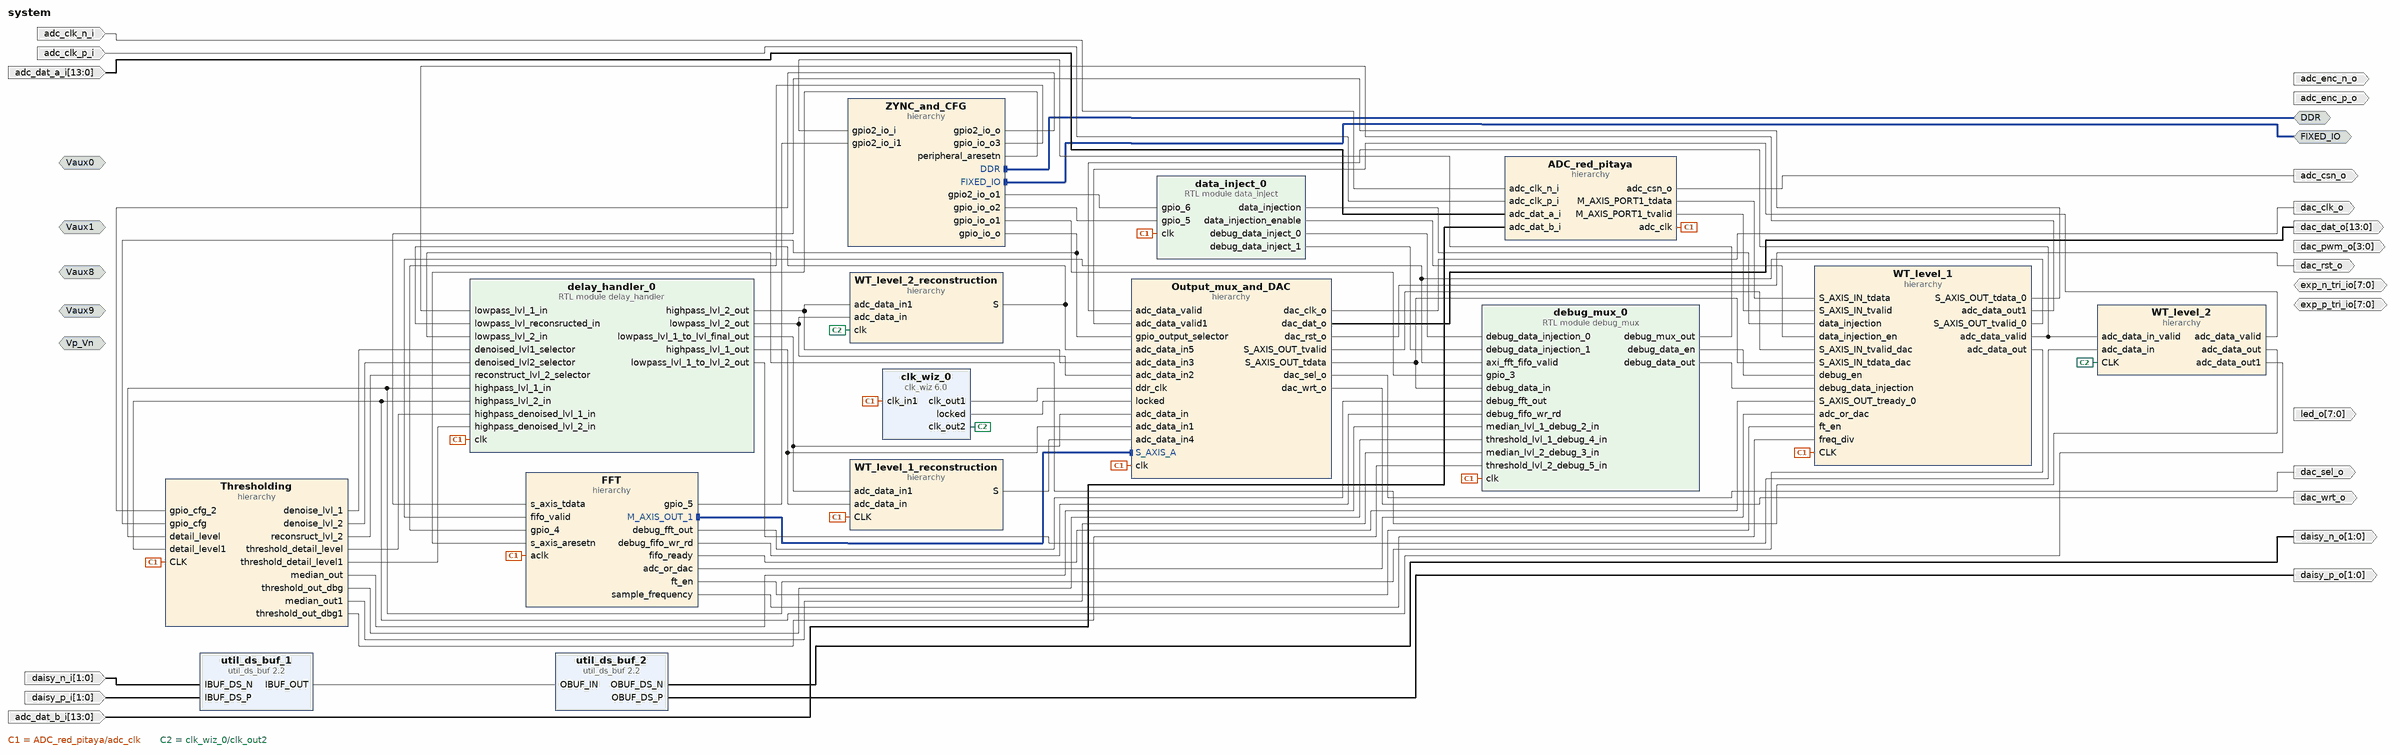
[diagram p0: block diagram of the top level]
# Vivado block design system, xc7z010clg400-1, Vivado 2022.2
create_bd_design system

create_bd_intf_port -mode Slave -vlnv xilinx.com:interface:diff_analog_io_rtl:1.0 Vp_Vn
create_bd_intf_port -mode Slave -vlnv xilinx.com:interface:diff_analog_io_rtl:1.0 Vaux0
create_bd_intf_port -mode Slave -vlnv xilinx.com:interface:diff_analog_io_rtl:1.0 Vaux1
create_bd_intf_port -mode Slave -vlnv xilinx.com:interface:diff_analog_io_rtl:1.0 Vaux9
create_bd_intf_port -mode Slave -vlnv xilinx.com:interface:diff_analog_io_rtl:1.0 Vaux8
create_bd_intf_port -mode Master -vlnv xilinx.com:interface:ddrx_rtl:1.0 DDR
create_bd_intf_port -mode Master -vlnv xilinx.com:display_processing_system7:fixedio_rtl:1.0 FIXED_IO
create_bd_port -dir I -from 13 -to 0 adc_dat_a_i
create_bd_port -dir I -from 13 -to 0 adc_dat_b_i
create_bd_port -dir I adc_clk_p_i
create_bd_port -dir I adc_clk_n_i
create_bd_port -dir O adc_enc_p_o
create_bd_port -dir O adc_enc_n_o
create_bd_port -dir O adc_csn_o
create_bd_port -dir O -from 13 -to 0 dac_dat_o
create_bd_port -dir O dac_clk_o
create_bd_port -dir O dac_rst_o
create_bd_port -dir O dac_sel_o
create_bd_port -dir O dac_wrt_o
create_bd_port -dir O -from 3 -to 0 dac_pwm_o
create_bd_port -dir IO -from 7 -to 0 exp_p_tri_io
create_bd_port -dir IO -from 7 -to 0 exp_n_tri_io
create_bd_port -dir O -from 1 -to 0 daisy_p_o
create_bd_port -dir O -from 1 -to 0 daisy_n_o
create_bd_port -dir I -from 1 -to 0 daisy_p_i
create_bd_port -dir I -from 1 -to 0 daisy_n_i
create_bd_port -dir O -from 7 -to 0 led_o

create_bd_cell -type ip -vlnv xilinx.com:ip:util_ds_buf:2.2 util_ds_buf_1
set_property -dict {CONFIG.C_SIZE 2} [get_bd_cells util_ds_buf_1]
create_bd_cell -type ip -vlnv xilinx.com:ip:util_ds_buf:2.2 util_ds_buf_2
set_property -dict {CONFIG.C_BUF_TYPE OBUFDS CONFIG.C_SIZE 2} [get_bd_cells util_ds_buf_2]
create_bd_cell -type ip -vlnv xilinx.com:ip:clk_wiz:6.0 clk_wiz_0
set_property -dict [list \
  CONFIG.CLKIN1_JITTER_PS 80.0 \
  CONFIG.CLKIN2_JITTER_PS 133.33 \
  CONFIG.CLKOUT1_JITTER 104.759 \
  CONFIG.CLKOUT1_PHASE_ERROR 96.948 \
  CONFIG.CLKOUT1_REQUESTED_OUT_FREQ 250.000 \
  CONFIG.CLKOUT2_JITTER 137.150 \
  CONFIG.CLKOUT2_PHASE_ERROR 96.948 \
  CONFIG.CLKOUT2_REQUESTED_OUT_FREQ 62.5 \
  CONFIG.CLKOUT2_USED true \
  CONFIG.CLKOUT3_JITTER 137.150 \
  CONFIG.CLKOUT3_PHASE_ERROR 96.948 \
  CONFIG.CLKOUT3_REQUESTED_OUT_FREQ 62.5 \
  CONFIG.CLKOUT3_USED false \
  CONFIG.MMCM_CLKFBOUT_MULT_F 8.000 \
  CONFIG.MMCM_CLKIN1_PERIOD 8.000 \
  CONFIG.MMCM_CLKIN2_PERIOD 10.000 \
  CONFIG.MMCM_CLKOUT0_DIVIDE_F 4.000 \
  CONFIG.MMCM_CLKOUT1_DIVIDE 16 \
  CONFIG.MMCM_CLKOUT2_DIVIDE 1 \
  CONFIG.MMCM_DIVCLK_DIVIDE 1 \
  CONFIG.NUM_OUT_CLKS 2 \
  CONFIG.PRIM_IN_FREQ 125.000 \
  CONFIG.SECONDARY_IN_FREQ 100.000 \
  CONFIG.SECONDARY_SOURCE Single_ended_clock_capable_pin \
  CONFIG.USE_INCLK_SWITCHOVER false \
  CONFIG.USE_RESET true \
] [get_bd_cells clk_wiz_0]
create_bd_cell -type hier ADC_red_pitaya
create_bd_cell -type module -reference data_inject data_inject_0
create_bd_cell -type module -reference delay_handler delay_handler_0
create_bd_cell -type hier FFT
create_bd_cell -type hier WT_level_1
create_bd_cell -type hier WT_level_2
create_bd_cell -type hier WT_level_1_reconstruction
create_bd_cell -type hier ZYNC_and_CFG
create_bd_cell -type hier Thresholding
create_bd_cell -type hier Output_mux_and_DAC
create_bd_cell -type hier WT_level_2_reconstruction
create_bd_cell -type module -reference debug_mux debug_mux_0

# ---- hierarchy /ADC_red_pitaya ----
current_bd_instance /ADC_red_pitaya
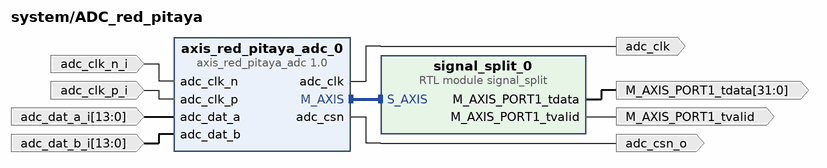
[diagram p1: block diagram inside /ADC_red_pitaya]
create_bd_pin -dir O -type clk adc_clk
create_bd_pin -dir O adc_csn_o
create_bd_pin -dir I adc_clk_p_i
create_bd_pin -dir I adc_clk_n_i
create_bd_pin -dir I -from 13 -to 0 adc_dat_a_i
create_bd_pin -dir I -from 13 -to 0 adc_dat_b_i
create_bd_pin -dir O -from 31 -to 0 M_AXIS_PORT1_tdata
create_bd_pin -dir O M_AXIS_PORT1_tvalid

create_bd_cell -type module -reference signal_split signal_split_0
create_bd_cell -type ip -vlnv pavel-demin:user:axis_red_pitaya_adc:1.0 axis_red_pitaya_adc_0

# ---- hierarchy /FFT ----
current_bd_instance /FFT
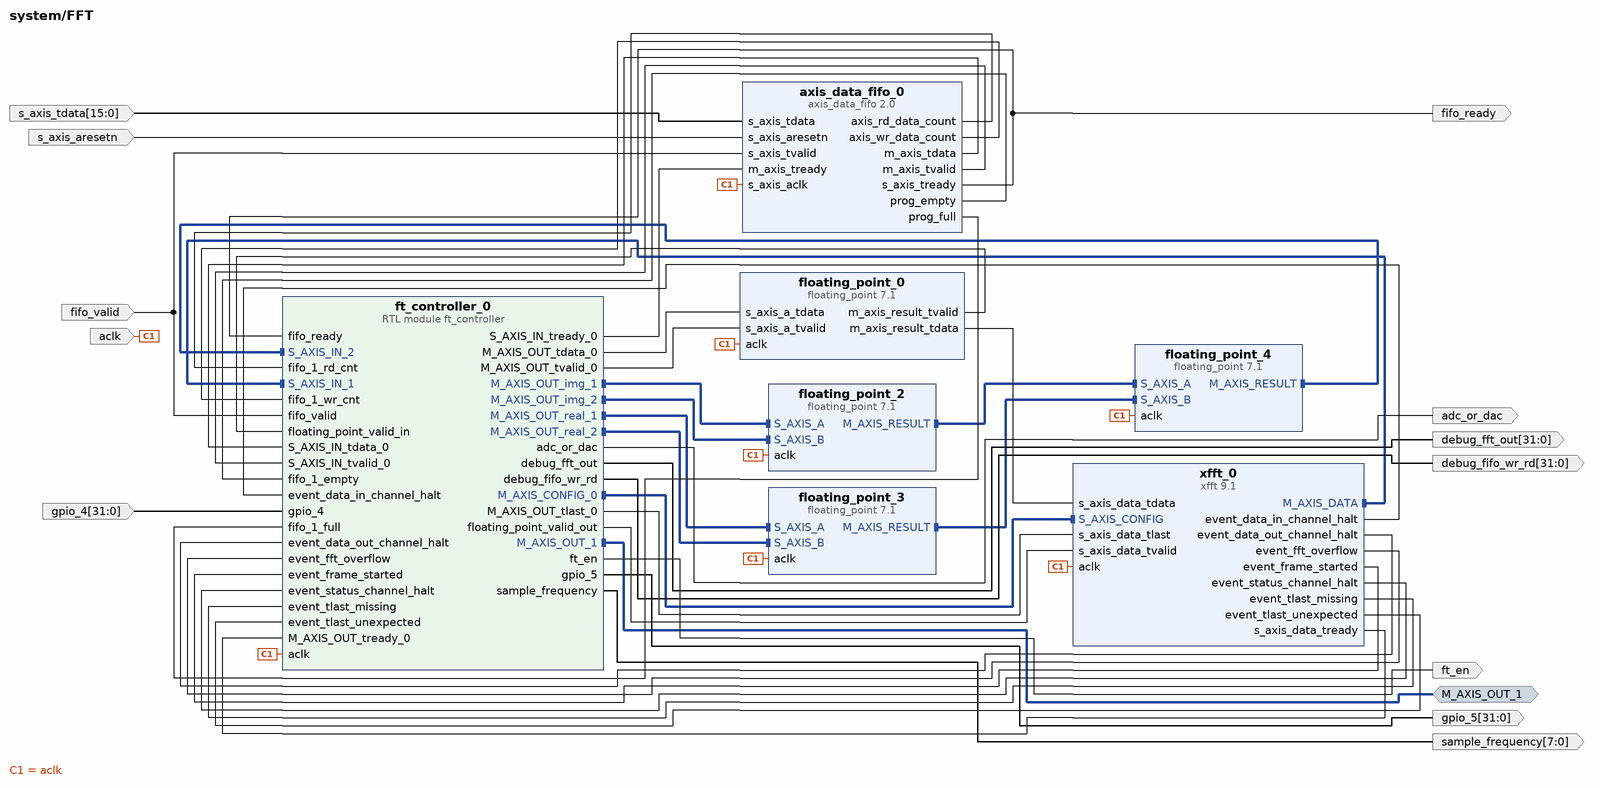
[diagram p2: block diagram inside /FFT]
create_bd_intf_pin -mode Master -vlnv xilinx.com:interface:axis_rtl:1.0 M_AXIS_OUT_1
create_bd_pin -dir I -type rst s_axis_aresetn
create_bd_pin -dir I -type clk aclk
create_bd_pin -dir I fifo_valid
create_bd_pin -dir O fifo_ready
create_bd_pin -dir I -from 15 -to 0 s_axis_tdata
create_bd_pin -dir I -from 31 -to 0 gpio_4
create_bd_pin -dir O -from 31 -to 0 gpio_5
create_bd_pin -dir O ft_en
create_bd_pin -dir O -from 7 -to 0 sample_frequency
create_bd_pin -dir O adc_or_dac
create_bd_pin -dir O -from 31 -to 0 debug_fft_out
create_bd_pin -dir O -from 31 -to 0 debug_fifo_wr_rd

create_bd_cell -type ip -vlnv xilinx.com:ip:axis_data_fifo:2.0 axis_data_fifo_0
set_property -dict [list \
  CONFIG.FIFO_DEPTH 4096 \
  CONFIG.HAS_PROG_EMPTY 1 \
  CONFIG.HAS_PROG_FULL 1 \
  CONFIG.HAS_RD_DATA_COUNT 1 \
  CONFIG.HAS_WR_DATA_COUNT 1 \
  CONFIG.PROG_FULL_THRESH 4091 \
  CONFIG.TDATA_NUM_BYTES 2 \
] [get_bd_cells axis_data_fifo_0]
create_bd_cell -type ip -vlnv xilinx.com:ip:floating_point:7.1 floating_point_3
set_property -dict [list \
  CONFIG.A_Precision_Type Single \
  CONFIG.C_A_Exponent_Width 8 \
  CONFIG.C_A_Fraction_Width 24 \
  CONFIG.C_Accum_Input_Msb -1 \
  CONFIG.C_Accum_Lsb -10 \
  CONFIG.C_Accum_Msb 32 \
  CONFIG.C_Latency 6 \
  CONFIG.C_Mult_Usage Max_Usage \
  CONFIG.C_Rate 1 \
  CONFIG.C_Result_Exponent_Width 8 \
  CONFIG.C_Result_Fraction_Width 24 \
  CONFIG.Flow_Control NonBlocking \
  CONFIG.Has_A_TLAST false \
  CONFIG.Has_RESULT_TREADY false \
  CONFIG.Maximum_Latency false \
  CONFIG.Operation_Type Multiply \
  CONFIG.RESULT_TLAST_Behv Null \
  CONFIG.Result_Precision_Type Single \
] [get_bd_cells floating_point_3]
create_bd_cell -type ip -vlnv xilinx.com:ip:floating_point:7.1 floating_point_4
set_property -dict [list \
  CONFIG.A_Precision_Type Single \
  CONFIG.Add_Sub_Value Add \
  CONFIG.C_A_Exponent_Width 8 \
  CONFIG.C_A_Fraction_Width 24 \
  CONFIG.C_Accum_Input_Msb -1 \
  CONFIG.C_Accum_Lsb -10 \
  CONFIG.C_Accum_Msb 32 \
  CONFIG.C_Latency 11 \
  CONFIG.C_Mult_Usage Full_Usage \
  CONFIG.C_Rate 1 \
  CONFIG.C_Result_Exponent_Width 8 \
  CONFIG.C_Result_Fraction_Width 24 \
  CONFIG.Flow_Control NonBlocking \
  CONFIG.Has_A_TLAST false \
  CONFIG.Has_RESULT_TREADY false \
  CONFIG.Maximum_Latency false \
  CONFIG.Operation_Type Add_Subtract \
  CONFIG.RESULT_TLAST_Behv Null \
  CONFIG.Result_Precision_Type Single \
] [get_bd_cells floating_point_4]
create_bd_cell -type ip -vlnv xilinx.com:ip:xfft:9.1 xfft_0
set_property -dict [list \
  CONFIG.data_format floating_point \
  CONFIG.implementation_options automatically_select \
  CONFIG.input_width 32 \
  CONFIG.number_of_stages_using_block_ram_for_data_and_phase_factors 5 \
  CONFIG.output_ordering natural_order \
  CONFIG.ovflo true \
  CONFIG.phase_factor_width 24 \
  CONFIG.run_time_configurable_transform_length true \
  CONFIG.target_clock_frequency 125 \
  CONFIG.transform_length 4096 \
] [get_bd_cells xfft_0]
create_bd_cell -type ip -vlnv xilinx.com:ip:floating_point:7.1 floating_point_0
set_property -dict [list \
  CONFIG.A_Precision_Type Custom \
  CONFIG.C_A_Exponent_Width 1 \
  CONFIG.C_A_Fraction_Width 13 \
  CONFIG.C_Accum_Input_Msb -1 \
  CONFIG.C_Accum_Lsb -10 \
  CONFIG.C_Accum_Msb 32 \
  CONFIG.C_Latency 6 \
  CONFIG.C_Mult_Usage No_Usage \
  CONFIG.C_Rate 1 \
  CONFIG.C_Result_Exponent_Width 8 \
  CONFIG.C_Result_Fraction_Width 24 \
  CONFIG.Flow_Control NonBlocking \
  CONFIG.Has_A_TLAST false \
  CONFIG.Has_RESULT_TREADY false \
  CONFIG.Maximum_Latency true \
  CONFIG.Operation_Type Fixed_to_float \
  CONFIG.RESULT_TLAST_Behv Null \
  CONFIG.Result_Precision_Type Single \
] [get_bd_cells floating_point_0]
create_bd_cell -type ip -vlnv xilinx.com:ip:floating_point:7.1 floating_point_2
set_property -dict [list \
  CONFIG.A_Precision_Type Single \
  CONFIG.C_A_Exponent_Width 8 \
  CONFIG.C_A_Fraction_Width 24 \
  CONFIG.C_Accum_Input_Msb -1 \
  CONFIG.C_Accum_Lsb -10 \
  CONFIG.C_Accum_Msb 32 \
  CONFIG.C_Latency 6 \
  CONFIG.C_Mult_Usage Max_Usage \
  CONFIG.C_Rate 1 \
  CONFIG.C_Result_Exponent_Width 8 \
  CONFIG.C_Result_Fraction_Width 24 \
  CONFIG.Flow_Control NonBlocking \
  CONFIG.Has_A_TLAST false \
  CONFIG.Has_RESULT_TREADY false \
  CONFIG.Maximum_Latency false \
  CONFIG.Operation_Type Multiply \
  CONFIG.RESULT_TLAST_Behv Null \
  CONFIG.Result_Precision_Type Single \
] [get_bd_cells floating_point_2]
create_bd_cell -type module -reference ft_controller ft_controller_0

# ---- hierarchy /WT_level_1 ----
current_bd_instance /WT_level_1
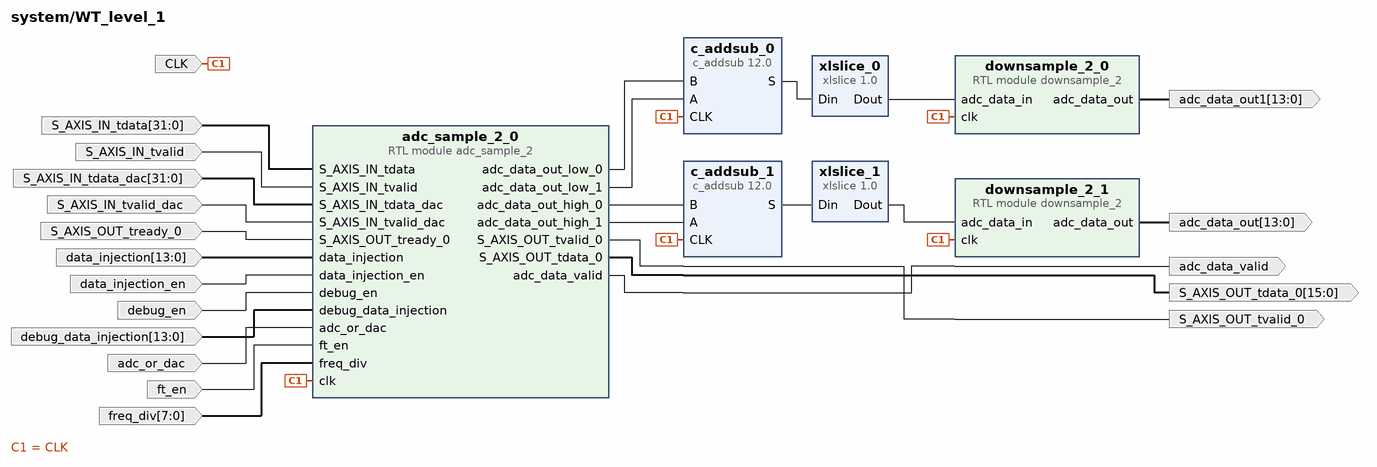
[diagram p3: block diagram inside /WT_level_1]
create_bd_pin -dir I -type clk CLK
create_bd_pin -dir O -from 13 -to 0 adc_data_out
create_bd_pin -dir I -from 31 -to 0 S_AXIS_IN_tdata
create_bd_pin -dir I S_AXIS_IN_tvalid
create_bd_pin -dir I -from 13 -to 0 debug_data_injection
create_bd_pin -dir I debug_en
create_bd_pin -dir I -from 13 -to 0 data_injection
create_bd_pin -dir I data_injection_en
create_bd_pin -dir I -from 31 -to 0 S_AXIS_IN_tdata_dac
create_bd_pin -dir I S_AXIS_IN_tvalid_dac
create_bd_pin -dir I ft_en
create_bd_pin -dir I -from 7 -to 0 freq_div
create_bd_pin -dir I adc_or_dac
create_bd_pin -dir O adc_data_valid
create_bd_pin -dir O -from 15 -to 0 S_AXIS_OUT_tdata_0
create_bd_pin -dir O S_AXIS_OUT_tvalid_0
create_bd_pin -dir I S_AXIS_OUT_tready_0
create_bd_pin -dir O -from 13 -to 0 adc_data_out1

create_bd_cell -type ip -vlnv xilinx.com:ip:xlslice:1.0 xlslice_0
set_property -dict {CONFIG.DIN_FROM 14 CONFIG.DIN_TO 1 CONFIG.DIN_WIDTH 15} [get_bd_cells xlslice_0]
create_bd_cell -type ip -vlnv xilinx.com:ip:xlslice:1.0 xlslice_1
set_property -dict {CONFIG.DIN_FROM 14 CONFIG.DIN_TO 1 CONFIG.DIN_WIDTH 15} [get_bd_cells xlslice_1]
create_bd_cell -type module -reference downsample_2 downsample_2_1
create_bd_cell -type ip -vlnv xilinx.com:ip:c_addsub:12.0 c_addsub_0
set_property -dict [list \
  CONFIG.A_Type Signed \
  CONFIG.A_Width 14 \
  CONFIG.B_Type Signed \
  CONFIG.B_Value 00000000000000 \
  CONFIG.B_Width 14 \
  CONFIG.CE false \
  CONFIG.Latency 1 \
  CONFIG.Out_Width 15 \
] [get_bd_cells c_addsub_0]
create_bd_cell -type ip -vlnv xilinx.com:ip:c_addsub:12.0 c_addsub_1
set_property -dict [list \
  CONFIG.A_Type Signed \
  CONFIG.A_Width 14 \
  CONFIG.Add_Mode Subtract \
  CONFIG.B_Type Signed \
  CONFIG.B_Value 00000000000000 \
  CONFIG.B_Width 14 \
  CONFIG.CE false \
  CONFIG.Latency 1 \
  CONFIG.Out_Width 15 \
] [get_bd_cells c_addsub_1]
create_bd_cell -type module -reference downsample_2 downsample_2_0
create_bd_cell -type module -reference adc_sample_2 adc_sample_2_0

# ---- hierarchy /WT_level_2 ----
current_bd_instance /WT_level_2
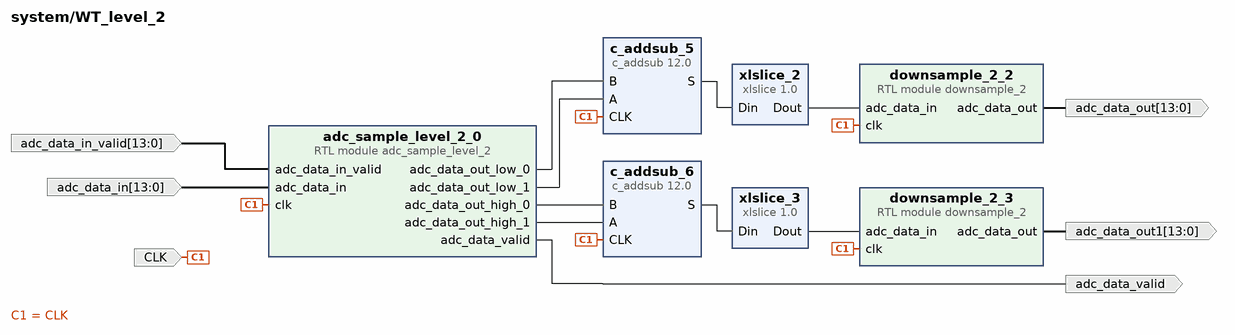
[diagram p4: block diagram inside /WT_level_2]
create_bd_pin -dir I -type clk CLK
create_bd_pin -dir O -from 13 -to 0 adc_data_out
create_bd_pin -dir I -from 13 -to 0 adc_data_in
create_bd_pin -dir I -from 13 -to 0 adc_data_in_valid
create_bd_pin -dir O adc_data_valid
create_bd_pin -dir O -from 13 -to 0 adc_data_out1

create_bd_cell -type ip -vlnv xilinx.com:ip:c_addsub:12.0 c_addsub_6
set_property -dict [list \
  CONFIG.A_Type Signed \
  CONFIG.A_Width 14 \
  CONFIG.Add_Mode Subtract \
  CONFIG.B_Type Signed \
  CONFIG.B_Value 00000000000000 \
  CONFIG.B_Width 14 \
  CONFIG.CE false \
  CONFIG.Latency 1 \
  CONFIG.Out_Width 15 \
] [get_bd_cells c_addsub_6]
create_bd_cell -type ip -vlnv xilinx.com:ip:xlslice:1.0 xlslice_2
set_property -dict {CONFIG.DIN_FROM 14 CONFIG.DIN_TO 1 CONFIG.DIN_WIDTH 15} [get_bd_cells xlslice_2]
create_bd_cell -type ip -vlnv xilinx.com:ip:xlslice:1.0 xlslice_3
set_property -dict {CONFIG.DIN_FROM 14 CONFIG.DIN_TO 1 CONFIG.DIN_WIDTH 15} [get_bd_cells xlslice_3]
create_bd_cell -type module -reference downsample_2 downsample_2_2
create_bd_cell -type module -reference adc_sample_level_2 adc_sample_level_2_0
create_bd_cell -type ip -vlnv xilinx.com:ip:c_addsub:12.0 c_addsub_5
set_property -dict [list \
  CONFIG.A_Type Signed \
  CONFIG.A_Width 14 \
  CONFIG.B_Type Signed \
  CONFIG.B_Value 00000000000000 \
  CONFIG.B_Width 14 \
  CONFIG.CE false \
  CONFIG.Latency 1 \
  CONFIG.Out_Width 15 \
] [get_bd_cells c_addsub_5]
create_bd_cell -type module -reference downsample_2 downsample_2_3

# ---- hierarchy /WT_level_1_reconstruction ----
current_bd_instance /WT_level_1_reconstruction
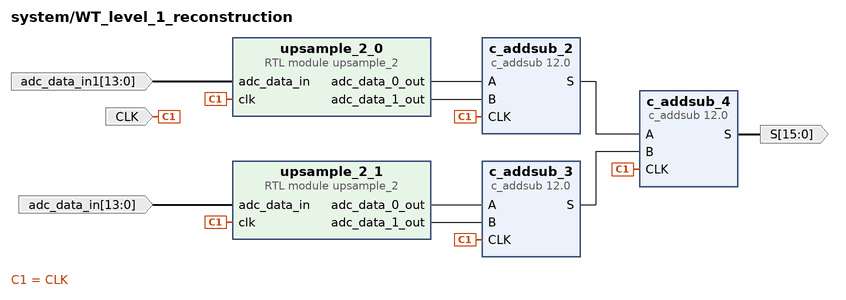
[diagram p5: block diagram inside /WT_level_1_reconstruction]
create_bd_pin -dir I -from 13 -to 0 adc_data_in
create_bd_pin -dir I -type clk CLK
create_bd_pin -dir O -from 15 -to 0 -type data S
create_bd_pin -dir I -from 13 -to 0 adc_data_in1

create_bd_cell -type module -reference upsample_2 upsample_2_1
create_bd_cell -type ip -vlnv xilinx.com:ip:c_addsub:12.0 c_addsub_2
set_property -dict [list \
  CONFIG.A_Type Signed \
  CONFIG.A_Width 14 \
  CONFIG.B_Type Signed \
  CONFIG.B_Value 00000000000000 \
  CONFIG.B_Width 14 \
  CONFIG.CE false \
  CONFIG.Latency 1 \
  CONFIG.Out_Width 15 \
] [get_bd_cells c_addsub_2]
create_bd_cell -type ip -vlnv xilinx.com:ip:c_addsub:12.0 c_addsub_3
set_property -dict [list \
  CONFIG.A_Type Signed \
  CONFIG.A_Width 14 \
  CONFIG.Add_Mode Subtract \
  CONFIG.B_Type Signed \
  CONFIG.B_Value 00000000000000 \
  CONFIG.B_Width 14 \
  CONFIG.CE false \
  CONFIG.Latency 1 \
  CONFIG.Out_Width 15 \
] [get_bd_cells c_addsub_3]
create_bd_cell -type ip -vlnv xilinx.com:ip:c_addsub:12.0 c_addsub_4
set_property -dict {CONFIG.CE false CONFIG.Latency 1 CONFIG.Out_Width 16} [get_bd_cells c_addsub_4]
create_bd_cell -type module -reference upsample_2 upsample_2_0

# ---- hierarchy /ZYNC_and_CFG ----
current_bd_instance /ZYNC_and_CFG
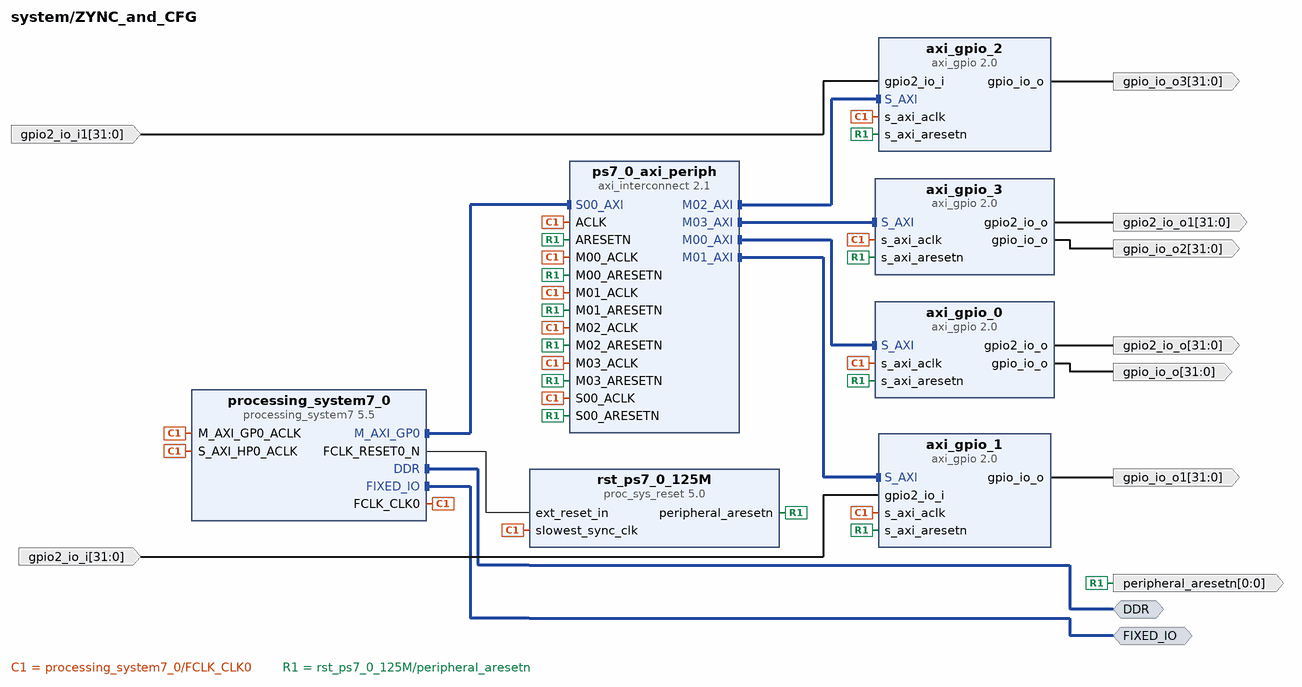
[diagram p6: block diagram inside /ZYNC_and_CFG]
create_bd_intf_pin -mode Master -vlnv xilinx.com:interface:ddrx_rtl:1.0 DDR
create_bd_intf_pin -mode Master -vlnv xilinx.com:display_processing_system7:fixedio_rtl:1.0 FIXED_IO
create_bd_pin -dir O -from 0 -to 0 -type rst peripheral_aresetn
create_bd_pin -dir O -from 31 -to 0 gpio_io_o
create_bd_pin -dir O -from 31 -to 0 gpio2_io_o
create_bd_pin -dir O -from 31 -to 0 gpio_io_o1
create_bd_pin -dir I -from 31 -to 0 gpio2_io_i
create_bd_pin -dir O -from 31 -to 0 gpio_io_o2
create_bd_pin -dir O -from 31 -to 0 gpio2_io_o1
create_bd_pin -dir O -from 31 -to 0 gpio_io_o3
create_bd_pin -dir I -from 31 -to 0 gpio2_io_i1

create_bd_cell -type ip -vlnv xilinx.com:ip:processing_system7:5.5 processing_system7_0
set_property -dict [list \
  CONFIG.PCW_APU_PERIPHERAL_FREQMHZ 666.666666 \
  CONFIG.PCW_ENET0_ENET0_IO {MIO 16 .. 27} \
  CONFIG.PCW_ENET0_GRP_MDIO_ENABLE 1 \
  CONFIG.PCW_ENET0_GRP_MDIO_IO EMIO \
  CONFIG.PCW_ENET0_PERIPHERAL_ENABLE 1 \
  CONFIG.PCW_ENET0_RESET_ENABLE 0 \
  CONFIG.PCW_ENET_RESET_ENABLE 1 \
  CONFIG.PCW_ENET_RESET_SELECT {Share reset pin} \
  CONFIG.PCW_FPGA0_PERIPHERAL_FREQMHZ 125 \
  CONFIG.PCW_FPGA1_PERIPHERAL_FREQMHZ 250 \
  CONFIG.PCW_FPGA3_PERIPHERAL_FREQMHZ 200 \
  CONFIG.PCW_GPIO_MIO_GPIO_ENABLE 1 \
  CONFIG.PCW_GPIO_MIO_GPIO_IO MIO \
  CONFIG.PCW_GPIO_PERIPHERAL_ENABLE 1 \
  CONFIG.PCW_I2C0_GRP_INT_ENABLE 0 \
  CONFIG.PCW_I2C0_I2C0_IO {MIO 50 .. 51} \
  CONFIG.PCW_I2C0_PERIPHERAL_ENABLE 1 \
  CONFIG.PCW_I2C_PERIPHERAL_FREQMHZ 111.111115 \
  CONFIG.PCW_I2C_RESET_ENABLE 1 \
  CONFIG.PCW_I2C_RESET_SELECT {Share reset pin} \
  CONFIG.PCW_IMPORT_BOARD_PRESET cfg/red_pitaya.xml \
  CONFIG.PCW_PRESET_BANK1_VOLTAGE {LVCMOS 2.5V} \
  CONFIG.PCW_QSPI_GRP_SINGLE_SS_ENABLE 1 \
  CONFIG.PCW_QSPI_GRP_SINGLE_SS_IO {MIO 1 .. 6} \
  CONFIG.PCW_QSPI_PERIPHERAL_ENABLE 1 \
  CONFIG.PCW_QSPI_PERIPHERAL_FREQMHZ 125 \
  CONFIG.PCW_QSPI_QSPI_IO {MIO 1 .. 6} \
  CONFIG.PCW_SD0_GRP_CD_ENABLE 1 \
  CONFIG.PCW_SD0_GRP_CD_IO {MIO 46} \
  CONFIG.PCW_SD0_GRP_WP_ENABLE 1 \
  CONFIG.PCW_SD0_GRP_WP_IO {MIO 47} \
  CONFIG.PCW_SD0_PERIPHERAL_ENABLE 1 \
  CONFIG.PCW_SD0_SD0_IO {MIO 40 .. 45} \
  CONFIG.PCW_SDIO_PERIPHERAL_FREQMHZ 100 \
  CONFIG.PCW_SINGLE_QSPI_DATA_MODE x4 \
  CONFIG.PCW_SPI0_PERIPHERAL_ENABLE 1 \
  CONFIG.PCW_SPI0_SPI0_IO EMIO \
  CONFIG.PCW_SPI1_PERIPHERAL_ENABLE 1 \
  CONFIG.PCW_SPI1_SPI1_IO {MIO 10 .. 15} \
  CONFIG.PCW_TTC0_PERIPHERAL_ENABLE 1 \
  CONFIG.PCW_TTC0_TTC0_IO EMIO \
  CONFIG.PCW_UART0_PERIPHERAL_ENABLE 1 \
  CONFIG.PCW_UART0_UART0_IO {MIO 14 .. 15} \
  CONFIG.PCW_UART1_PERIPHERAL_ENABLE 1 \
  CONFIG.PCW_UART1_UART1_IO {MIO 8 .. 9} \
  CONFIG.PCW_UART_PERIPHERAL_FREQMHZ 100 \
  CONFIG.PCW_UIPARAM_DDR_BUS_WIDTH {16 Bit} \
  CONFIG.PCW_UIPARAM_DDR_FREQ_MHZ 533.333333 \
  CONFIG.PCW_UIPARAM_DDR_PARTNO {MT41J256M16 RE-125} \
  CONFIG.PCW_USB0_PERIPHERAL_ENABLE 1 \
  CONFIG.PCW_USB0_RESET_ENABLE 1 \
  CONFIG.PCW_USB0_RESET_IO {MIO 48} \
  CONFIG.PCW_USB0_USB0_IO {MIO 28 .. 39} \
  CONFIG.PCW_USB_RESET_ENABLE 1 \
  CONFIG.PCW_USB_RESET_SELECT {Share reset pin} \
  CONFIG.PCW_USE_S_AXI_HP0 1 \
] [get_bd_cells processing_system7_0]
# 429 more settings of processing_system7_0 are not shown: defaults, MIO pin electricals, DDR timing, and values the tool derives
create_bd_cell -type ip -vlnv xilinx.com:ip:axi_gpio:2.0 axi_gpio_0
set_property -dict [list \
  CONFIG.C_ALL_INPUTS_2 0 \
  CONFIG.C_ALL_OUTPUTS 1 \
  CONFIG.C_ALL_OUTPUTS_2 1 \
  CONFIG.C_DOUT_DEFAULT 0x8C180001 \
  CONFIG.C_DOUT_DEFAULT_2 0x00002000 \
  CONFIG.C_IS_DUAL 1 \
] [get_bd_cells axi_gpio_0]
create_bd_cell -type ip -vlnv xilinx.com:ip:axi_gpio:2.0 axi_gpio_1
set_property -dict [list \
  CONFIG.C_ALL_INPUTS 0 \
  CONFIG.C_ALL_INPUTS_2 1 \
  CONFIG.C_ALL_OUTPUTS 1 \
  CONFIG.C_DOUT_DEFAULT 0x00000000 \
  CONFIG.C_INTERRUPT_PRESENT 0 \
  CONFIG.C_IS_DUAL 1 \
] [get_bd_cells axi_gpio_1]
create_bd_cell -type ip -vlnv xilinx.com:ip:axi_gpio:2.0 axi_gpio_3
set_property -dict [list \
  CONFIG.C_ALL_INPUTS_2 0 \
  CONFIG.C_ALL_OUTPUTS 1 \
  CONFIG.C_ALL_OUTPUTS_2 1 \
  CONFIG.C_DOUT_DEFAULT 0x00000000 \
  CONFIG.C_DOUT_DEFAULT_2 0x00000000 \
  CONFIG.C_IS_DUAL 1 \
] [get_bd_cells axi_gpio_3]
create_bd_cell -type ip -vlnv xilinx.com:ip:proc_sys_reset:5.0 rst_ps7_0_125M
create_bd_cell -type ip -vlnv xilinx.com:ip:axi_gpio:2.0 axi_gpio_2
set_property -dict [list \
  CONFIG.C_ALL_INPUTS_2 1 \
  CONFIG.C_ALL_OUTPUTS 1 \
  CONFIG.C_DOUT_DEFAULT 0x0000002C \
  CONFIG.C_IS_DUAL 1 \
] [get_bd_cells axi_gpio_2]
create_bd_cell -type ip -vlnv xilinx.com:ip:axi_interconnect:2.1 ps7_0_axi_periph
set_property -dict {CONFIG.NUM_MI 4 CONFIG.NUM_SI 1} [get_bd_cells ps7_0_axi_periph]

# ---- hierarchy /Thresholding ----
current_bd_instance /Thresholding
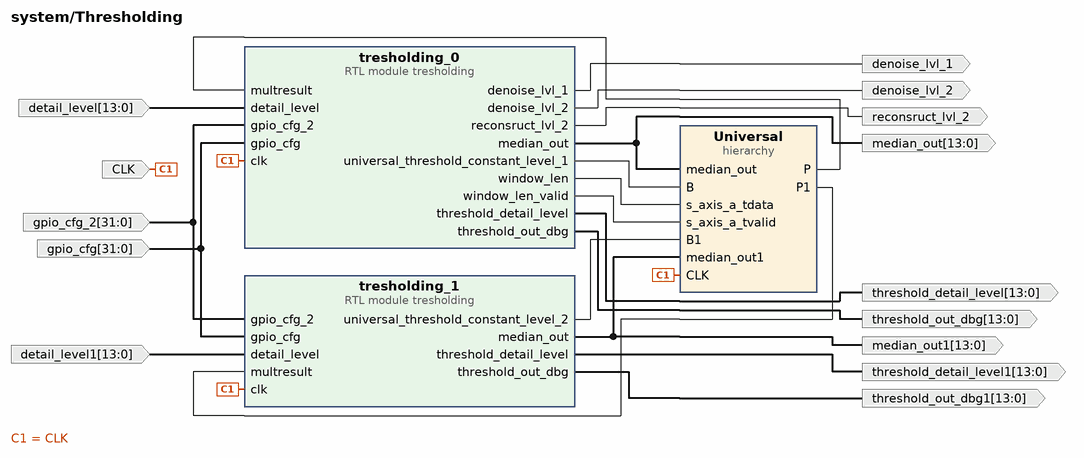
[diagram p7: block diagram inside /Thresholding]
create_bd_pin -dir I -type clk CLK
create_bd_pin -dir O -from 13 -to 0 median_out
create_bd_pin -dir I -from 13 -to 0 detail_level
create_bd_pin -dir I -from 31 -to 0 gpio_cfg
create_bd_pin -dir I -from 31 -to 0 gpio_cfg_2
create_bd_pin -dir O -from 13 -to 0 threshold_detail_level
create_bd_pin -dir O -from 13 -to 0 threshold_out_dbg
create_bd_pin -dir O denoise_lvl_1
create_bd_pin -dir O denoise_lvl_2
create_bd_pin -dir O reconsruct_lvl_2
create_bd_pin -dir O -from 13 -to 0 median_out1
create_bd_pin -dir I -from 13 -to 0 detail_level1
create_bd_pin -dir O -from 13 -to 0 threshold_detail_level1
create_bd_pin -dir O -from 13 -to 0 threshold_out_dbg1

create_bd_cell -type hier Universal
create_bd_cell -type module -reference tresholding tresholding_0
create_bd_cell -type module -reference tresholding tresholding_1

# ---- hierarchy /Thresholding/Universal ----
current_bd_instance /Thresholding/Universal
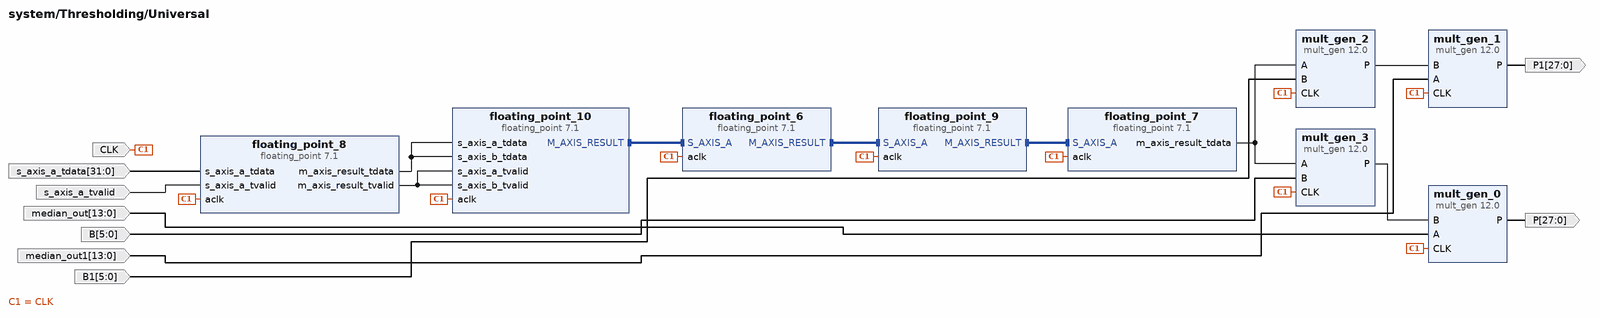
[diagram p8: block diagram inside /Thresholding/Universal]
create_bd_pin -dir I -type clk CLK
create_bd_pin -dir I -from 13 -to 0 median_out
create_bd_pin -dir O -from 27 -to 0 -type data P
create_bd_pin -dir I -from 13 -to 0 -type data median_out1
create_bd_pin -dir O -from 27 -to 0 -type data P1
create_bd_pin -dir I -from 5 -to 0 -type data B
create_bd_pin -dir I s_axis_a_tvalid
create_bd_pin -dir I -from 31 -to 0 s_axis_a_tdata
create_bd_pin -dir I -from 5 -to 0 -type data B1

create_bd_cell -type ip -vlnv xilinx.com:ip:mult_gen:12.0 mult_gen_0
set_property -dict [list \
  CONFIG.MultType Parallel_Multiplier \
  CONFIG.Multiplier_Construction Use_Mults \
  CONFIG.OptGoal Area \
  CONFIG.PipeStages 3 \
  CONFIG.PortAType Unsigned \
  CONFIG.PortAWidth 14 \
  CONFIG.PortBType Unsigned \
  CONFIG.PortBWidth 14 \
] [get_bd_cells mult_gen_0]
create_bd_cell -type ip -vlnv xilinx.com:ip:mult_gen:12.0 mult_gen_1
set_property -dict [list \
  CONFIG.MultType Parallel_Multiplier \
  CONFIG.Multiplier_Construction Use_Mults \
  CONFIG.OptGoal Area \
  CONFIG.PipeStages 3 \
  CONFIG.PortAType Unsigned \
  CONFIG.PortAWidth 14 \
  CONFIG.PortBType Unsigned \
  CONFIG.PortBWidth 14 \
] [get_bd_cells mult_gen_1]
create_bd_cell -type ip -vlnv xilinx.com:ip:floating_point:7.1 floating_point_6
set_property -dict [list \
  CONFIG.A_Precision_Type Single \
  CONFIG.C_A_Exponent_Width 8 \
  CONFIG.C_A_Fraction_Width 24 \
  CONFIG.C_Accum_Input_Msb -1 \
  CONFIG.C_Accum_Lsb -10 \
  CONFIG.C_Accum_Msb 32 \
  CONFIG.C_Latency 22 \
  CONFIG.C_Mult_Usage Medium_Usage \
  CONFIG.C_Rate 1 \
  CONFIG.C_Result_Exponent_Width 8 \
  CONFIG.C_Result_Fraction_Width 24 \
  CONFIG.Flow_Control NonBlocking \
  CONFIG.Has_RESULT_TREADY false \
  CONFIG.Operation_Type Logarithm \
  CONFIG.Result_Precision_Type Single \
] [get_bd_cells floating_point_6]
create_bd_cell -type ip -vlnv xilinx.com:ip:mult_gen:12.0 mult_gen_3
set_property -dict [list \
  CONFIG.MultType Parallel_Multiplier \
  CONFIG.Multiplier_Construction Use_LUTs \
  CONFIG.OptGoal Speed \
  CONFIG.PipeStages 2 \
  CONFIG.PortAType Unsigned \
  CONFIG.PortAWidth 8 \
  CONFIG.PortBType Unsigned \
  CONFIG.PortBWidth 6 \
] [get_bd_cells mult_gen_3]
create_bd_cell -type ip -vlnv xilinx.com:ip:floating_point:7.1 floating_point_7
set_property -dict [list \
  CONFIG.A_Precision_Type Single \
  CONFIG.C_A_Exponent_Width 8 \
  CONFIG.C_A_Fraction_Width 24 \
  CONFIG.C_Accum_Input_Msb -1 \
  CONFIG.C_Accum_Lsb -10 \
  CONFIG.C_Accum_Msb 32 \
  CONFIG.C_Latency 6 \
  CONFIG.C_Mult_Usage No_Usage \
  CONFIG.C_Rate 1 \
  CONFIG.C_Result_Exponent_Width 6 \
  CONFIG.C_Result_Fraction_Width 2 \
  CONFIG.Flow_Control NonBlocking \
  CONFIG.Has_RESULT_TREADY false \
  CONFIG.Operation_Type Float_to_fixed \
  CONFIG.Result_Precision_Type Custom \
] [get_bd_cells floating_point_7]
create_bd_cell -type ip -vlnv xilinx.com:ip:floating_point:7.1 floating_point_8
set_property -dict [list \
  CONFIG.A_Precision_Type Int32 \
  CONFIG.C_A_Exponent_Width 32 \
  CONFIG.C_A_Fraction_Width 0 \
  CONFIG.C_Accum_Input_Msb -1 \
  CONFIG.C_Accum_Lsb -10 \
  CONFIG.C_Accum_Msb 32 \
  CONFIG.C_Latency 6 \
  CONFIG.C_Mult_Usage No_Usage \
  CONFIG.C_Rate 1 \
  CONFIG.C_Result_Exponent_Width 8 \
  CONFIG.C_Result_Fraction_Width 24 \
  CONFIG.Flow_Control NonBlocking \
  CONFIG.Has_RESULT_TREADY false \
  CONFIG.Operation_Type Fixed_to_float \
  CONFIG.Result_Precision_Type Single \
] [get_bd_cells floating_point_8]
create_bd_cell -type ip -vlnv xilinx.com:ip:floating_point:7.1 floating_point_9
set_property -dict [list \
  CONFIG.A_Precision_Type Single \
  CONFIG.C_A_Exponent_Width 8 \
  CONFIG.C_A_Fraction_Width 24 \
  CONFIG.C_Accum_Input_Msb -1 \
  CONFIG.C_Accum_Lsb -10 \
  CONFIG.C_Accum_Msb 32 \
  CONFIG.C_Latency 28 \
  CONFIG.C_Mult_Usage No_Usage \
  CONFIG.C_Rate 1 \
  CONFIG.C_Result_Exponent_Width 8 \
  CONFIG.C_Result_Fraction_Width 24 \
  CONFIG.Flow_Control NonBlocking \
  CONFIG.Has_RESULT_TREADY false \
  CONFIG.Operation_Type Square_root \
  CONFIG.Result_Precision_Type Single \
] [get_bd_cells floating_point_9]
create_bd_cell -type ip -vlnv xilinx.com:ip:floating_point:7.1 floating_point_10
set_property -dict [list \
  CONFIG.A_Precision_Type Single \
  CONFIG.C_A_Exponent_Width 8 \
  CONFIG.C_A_Fraction_Width 24 \
  CONFIG.C_Accum_Input_Msb -1 \
  CONFIG.C_Accum_Lsb -10 \
  CONFIG.C_Accum_Msb 32 \
  CONFIG.C_Latency 8 \
  CONFIG.C_Mult_Usage Medium_Usage \
  CONFIG.C_Rate 1 \
  CONFIG.C_Result_Exponent_Width 8 \
  CONFIG.C_Result_Fraction_Width 24 \
  CONFIG.Flow_Control NonBlocking \
  CONFIG.Has_RESULT_TREADY false \
  CONFIG.Operation_Type Multiply \
  CONFIG.Result_Precision_Type Single \
] [get_bd_cells floating_point_10]
create_bd_cell -type ip -vlnv xilinx.com:ip:mult_gen:12.0 mult_gen_2
set_property -dict [list \
  CONFIG.MultType Parallel_Multiplier \
  CONFIG.Multiplier_Construction Use_LUTs \
  CONFIG.OptGoal Speed \
  CONFIG.PipeStages 2 \
  CONFIG.PortAType Unsigned \
  CONFIG.PortAWidth 8 \
  CONFIG.PortBType Unsigned \
  CONFIG.PortBWidth 6 \
] [get_bd_cells mult_gen_2]

# ---- hierarchy /Output_mux_and_DAC ----
current_bd_instance /Output_mux_and_DAC
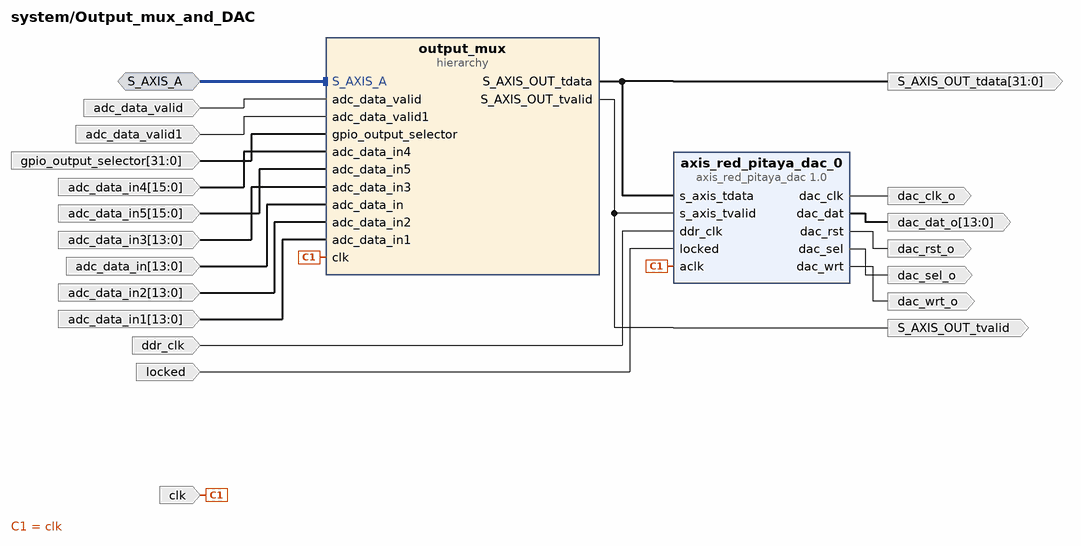
[diagram p9: block diagram inside /Output_mux_and_DAC]
create_bd_intf_pin -mode Slave -vlnv xilinx.com:interface:axis_rtl:1.0 S_AXIS_A
create_bd_pin -dir I -type clk clk
create_bd_pin -dir I -type clk ddr_clk
create_bd_pin -dir I locked
create_bd_pin -dir O -type clk dac_clk_o
create_bd_pin -dir O -type rst dac_rst_o
create_bd_pin -dir O dac_sel_o
create_bd_pin -dir O dac_wrt_o
create_bd_pin -dir O -from 13 -to 0 dac_dat_o
create_bd_pin -dir O -from 31 -to 0 S_AXIS_OUT_tdata
create_bd_pin -dir O S_AXIS_OUT_tvalid
create_bd_pin -dir I -from 13 -to 0 adc_data_in
create_bd_pin -dir I adc_data_valid
create_bd_pin -dir I -from 13 -to 0 adc_data_in1
create_bd_pin -dir I -from 13 -to 0 adc_data_in2
create_bd_pin -dir I adc_data_valid1
create_bd_pin -dir I -from 13 -to 0 adc_data_in3
create_bd_pin -dir I -from 15 -to 0 adc_data_in4
create_bd_pin -dir I -from 15 -to 0 adc_data_in5
create_bd_pin -dir I -from 31 -to 0 gpio_output_selector

create_bd_cell -type ip -vlnv pavel-demin:user:axis_red_pitaya_dac:1.0 axis_red_pitaya_dac_0
create_bd_cell -type hier output_mux

# ---- hierarchy /Output_mux_and_DAC/output_mux ----
current_bd_instance /Output_mux_and_DAC/output_mux
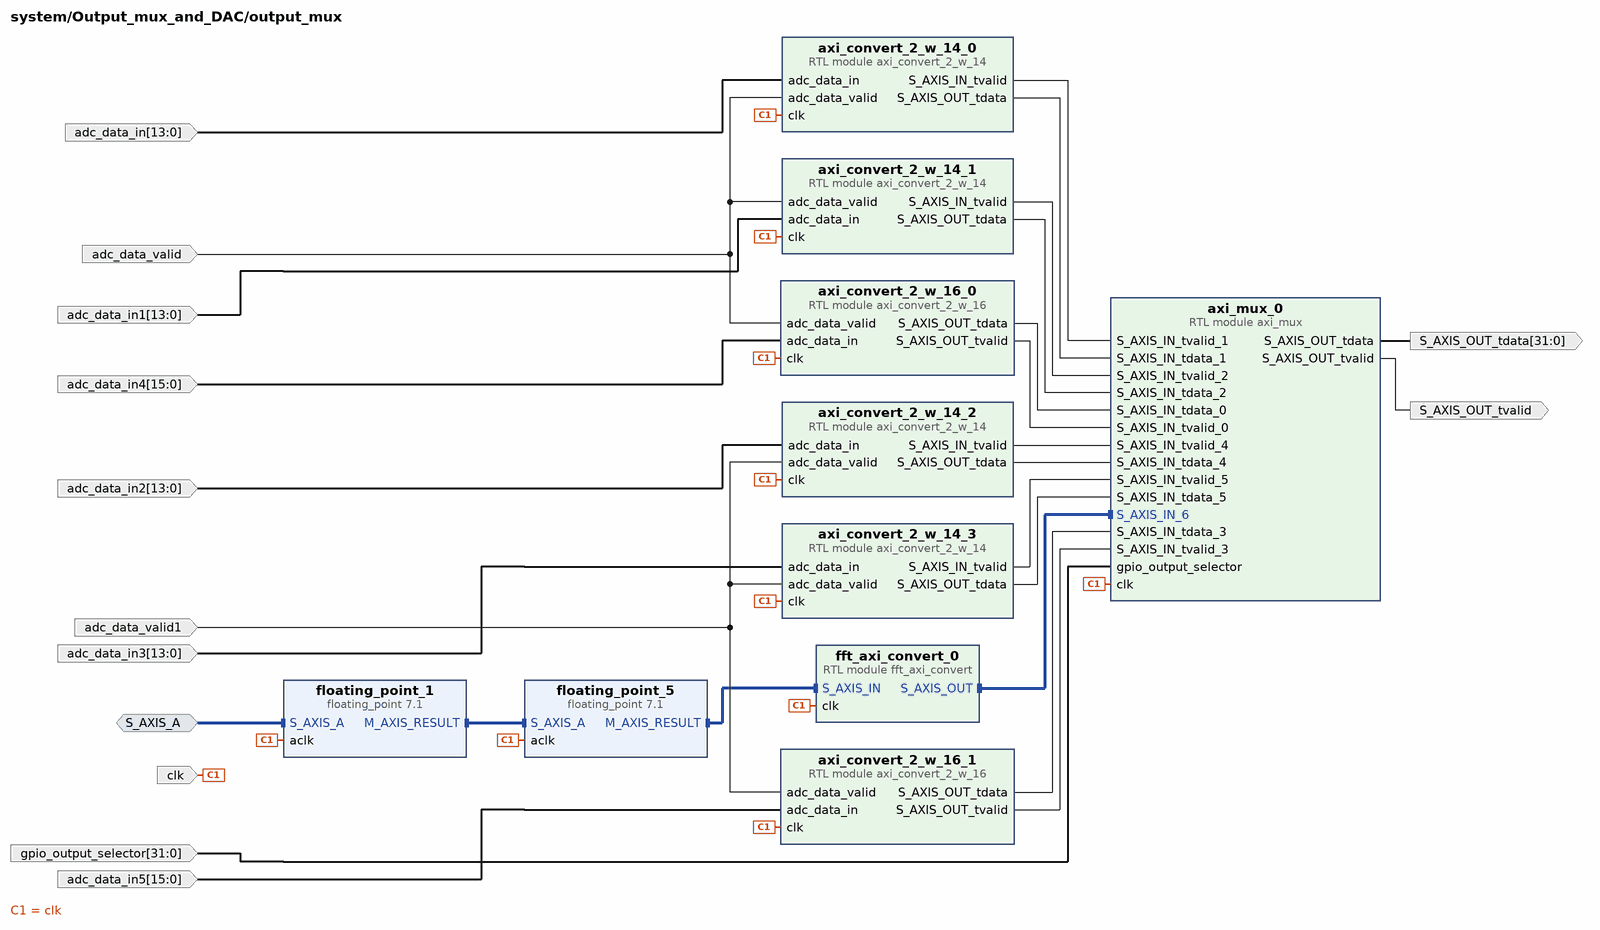
[diagram p10: block diagram inside /Output_mux_and_DAC/output_mux]
create_bd_intf_pin -mode Slave -vlnv xilinx.com:interface:axis_rtl:1.0 S_AXIS_A
create_bd_pin -dir I -type clk clk
create_bd_pin -dir I -from 13 -to 0 adc_data_in
create_bd_pin -dir I adc_data_valid
create_bd_pin -dir I -from 13 -to 0 adc_data_in1
create_bd_pin -dir I -from 13 -to 0 adc_data_in2
create_bd_pin -dir I adc_data_valid1
create_bd_pin -dir I -from 13 -to 0 adc_data_in3
create_bd_pin -dir I -from 15 -to 0 adc_data_in4
create_bd_pin -dir I -from 15 -to 0 adc_data_in5
create_bd_pin -dir I -from 31 -to 0 gpio_output_selector
create_bd_pin -dir O -from 31 -to 0 S_AXIS_OUT_tdata
create_bd_pin -dir O S_AXIS_OUT_tvalid

create_bd_cell -type module -reference axi_convert_2_w_14 axi_convert_2_w_14_0
create_bd_cell -type module -reference axi_convert_2_w_14 axi_convert_2_w_14_1
create_bd_cell -type module -reference axi_convert_2_w_14 axi_convert_2_w_14_2
create_bd_cell -type module -reference axi_convert_2_w_14 axi_convert_2_w_14_3
create_bd_cell -type module -reference fft_axi_convert fft_axi_convert_0
create_bd_cell -type module -reference axi_convert_2_w_16 axi_convert_2_w_16_0
create_bd_cell -type module -reference axi_convert_2_w_16 axi_convert_2_w_16_1
create_bd_cell -type module -reference axi_mux axi_mux_0
create_bd_cell -type ip -vlnv xilinx.com:ip:floating_point:7.1 floating_point_5
set_property -dict [list \
  CONFIG.A_Precision_Type Single \
  CONFIG.C_A_Exponent_Width 8 \
  CONFIG.C_A_Fraction_Width 24 \
  CONFIG.C_Accum_Input_Msb -1 \
  CONFIG.C_Accum_Lsb -10 \
  CONFIG.C_Accum_Msb 32 \
  CONFIG.C_Has_OVERFLOW true \
  CONFIG.C_Latency 6 \
  CONFIG.C_Mult_Usage No_Usage \
  CONFIG.C_Rate 1 \
  CONFIG.C_Result_Exponent_Width 13 \
  CONFIG.C_Result_Fraction_Width 19 \
  CONFIG.Flow_Control NonBlocking \
  CONFIG.Has_RESULT_TREADY false \
  CONFIG.Operation_Type Float_to_fixed \
  CONFIG.Result_Precision_Type Custom \
] [get_bd_cells floating_point_5]
create_bd_cell -type ip -vlnv xilinx.com:ip:floating_point:7.1 floating_point_1
set_property -dict [list \
  CONFIG.A_Precision_Type Single \
  CONFIG.C_A_Exponent_Width 8 \
  CONFIG.C_A_Fraction_Width 24 \
  CONFIG.C_Accum_Input_Msb -1 \
  CONFIG.C_Accum_Lsb -10 \
  CONFIG.C_Accum_Msb 32 \
  CONFIG.C_Latency 28 \
  CONFIG.C_Mult_Usage No_Usage \
  CONFIG.C_Rate 1 \
  CONFIG.C_Result_Exponent_Width 8 \
  CONFIG.C_Result_Fraction_Width 24 \
  CONFIG.Flow_Control NonBlocking \
  CONFIG.Has_RESULT_TREADY false \
  CONFIG.Operation_Type Square_root \
  CONFIG.Result_Precision_Type Single \
] [get_bd_cells floating_point_1]

# ---- hierarchy /WT_level_2_reconstruction ----
current_bd_instance /WT_level_2_reconstruction
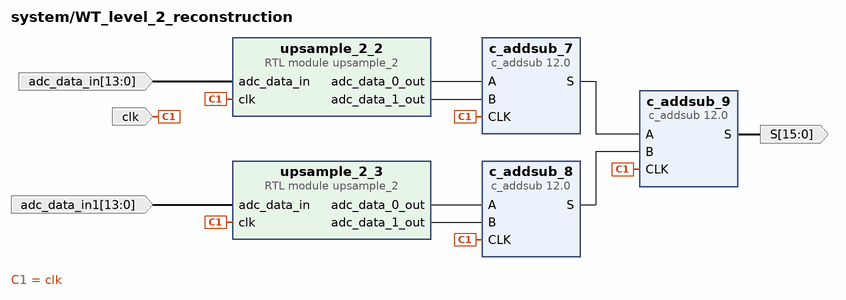
[diagram p11: block diagram inside /WT_level_2_reconstruction]
create_bd_pin -dir I -type clk clk
create_bd_pin -dir I -from 13 -to 0 adc_data_in
create_bd_pin -dir I -from 13 -to 0 adc_data_in1
create_bd_pin -dir O -from 15 -to 0 -type data S

create_bd_cell -type ip -vlnv xilinx.com:ip:c_addsub:12.0 c_addsub_7
set_property -dict [list \
  CONFIG.A_Type Signed \
  CONFIG.A_Width 14 \
  CONFIG.B_Type Signed \
  CONFIG.B_Value 00000000000000 \
  CONFIG.B_Width 14 \
  CONFIG.CE false \
  CONFIG.Latency 1 \
  CONFIG.Out_Width 15 \
] [get_bd_cells c_addsub_7]
create_bd_cell -type ip -vlnv xilinx.com:ip:c_addsub:12.0 c_addsub_8
set_property -dict [list \
  CONFIG.A_Type Signed \
  CONFIG.A_Width 14 \
  CONFIG.Add_Mode Subtract \
  CONFIG.B_Type Signed \
  CONFIG.B_Value 00000000000000 \
  CONFIG.B_Width 14 \
  CONFIG.CE false \
  CONFIG.Latency 1 \
  CONFIG.Out_Width 15 \
] [get_bd_cells c_addsub_8]
create_bd_cell -type module -reference upsample_2 upsample_2_2
create_bd_cell -type module -reference upsample_2 upsample_2_3
create_bd_cell -type ip -vlnv xilinx.com:ip:c_addsub:12.0 c_addsub_9
set_property -dict {CONFIG.CE false CONFIG.Latency 1 CONFIG.Out_Width 16} [get_bd_cells c_addsub_9]

# ---- connections ----

current_bd_instance /ADC_red_pitaya
connect_bd_intf_net [get_bd_intf_pins axis_red_pitaya_adc_0/M_AXIS] [get_bd_intf_pins signal_split_0/S_AXIS]
connect_bd_net [get_bd_pins adc_clk_n_i] [get_bd_pins axis_red_pitaya_adc_0/adc_clk_n]
connect_bd_net [get_bd_pins adc_clk_p_i] [get_bd_pins axis_red_pitaya_adc_0/adc_clk_p]
connect_bd_net [get_bd_pins adc_dat_a_i] [get_bd_pins axis_red_pitaya_adc_0/adc_dat_a]
connect_bd_net [get_bd_pins adc_dat_b_i] [get_bd_pins axis_red_pitaya_adc_0/adc_dat_b]
connect_bd_net [get_bd_pins axis_red_pitaya_adc_0/adc_clk] [get_bd_pins adc_clk]
connect_bd_net [get_bd_pins axis_red_pitaya_adc_0/adc_csn] [get_bd_pins adc_csn_o]
connect_bd_net [get_bd_pins signal_split_0/M_AXIS_PORT1_tdata] [get_bd_pins M_AXIS_PORT1_tdata]
connect_bd_net [get_bd_pins signal_split_0/M_AXIS_PORT1_tvalid] [get_bd_pins M_AXIS_PORT1_tvalid]

current_bd_instance /FFT
connect_bd_intf_net [get_bd_intf_pins floating_point_2/M_AXIS_RESULT] [get_bd_intf_pins floating_point_4/S_AXIS_A]
connect_bd_intf_net [get_bd_intf_pins floating_point_3/M_AXIS_RESULT] [get_bd_intf_pins floating_point_4/S_AXIS_B]
connect_bd_intf_net [get_bd_intf_pins ft_controller_0/S_AXIS_IN_2] [get_bd_intf_pins floating_point_4/M_AXIS_RESULT]
connect_bd_intf_net [get_bd_intf_pins ft_controller_0/M_AXIS_CONFIG_0] [get_bd_intf_pins xfft_0/S_AXIS_CONFIG]
connect_bd_intf_net [get_bd_intf_pins M_AXIS_OUT_1] [get_bd_intf_pins ft_controller_0/M_AXIS_OUT_1]
connect_bd_intf_net [get_bd_intf_pins ft_controller_0/M_AXIS_OUT_img_1] [get_bd_intf_pins floating_point_2/S_AXIS_A]
connect_bd_intf_net [get_bd_intf_pins ft_controller_0/M_AXIS_OUT_img_2] [get_bd_intf_pins floating_point_2/S_AXIS_B]
connect_bd_intf_net [get_bd_intf_pins ft_controller_0/M_AXIS_OUT_real_1] [get_bd_intf_pins floating_point_3/S_AXIS_A]
connect_bd_intf_net [get_bd_intf_pins floating_point_3/S_AXIS_B] [get_bd_intf_pins ft_controller_0/M_AXIS_OUT_real_2]
connect_bd_intf_net [get_bd_intf_pins xfft_0/M_AXIS_DATA] [get_bd_intf_pins ft_controller_0/S_AXIS_IN_1]
connect_bd_net [get_bd_pins fifo_valid] [get_bd_pins axis_data_fifo_0/s_axis_tvalid] [get_bd_pins ft_controller_0/fifo_valid]
connect_bd_net -net adc_sample_2_0_S_AXIS_OUT_tdata_0 [get_bd_pins s_axis_tdata] [get_bd_pins axis_data_fifo_0/s_axis_tdata]
connect_bd_net -net axi_gpio_2_gpio_io_o [get_bd_pins gpio_4] [get_bd_pins ft_controller_0/gpio_4]
connect_bd_net [get_bd_pins axis_data_fifo_0/axis_rd_data_count] [get_bd_pins ft_controller_0/fifo_1_rd_cnt]
connect_bd_net [get_bd_pins axis_data_fifo_0/axis_wr_data_count] [get_bd_pins ft_controller_0/fifo_1_wr_cnt]
connect_bd_net [get_bd_pins axis_data_fifo_0/m_axis_tdata] [get_bd_pins ft_controller_0/S_AXIS_IN_tdata_0]
connect_bd_net [get_bd_pins axis_data_fifo_0/m_axis_tvalid] [get_bd_pins ft_controller_0/S_AXIS_IN_tvalid_0]
connect_bd_net [get_bd_pins axis_data_fifo_0/prog_empty] [get_bd_pins ft_controller_0/fifo_1_empty]
connect_bd_net [get_bd_pins axis_data_fifo_0/prog_full] [get_bd_pins ft_controller_0/fifo_1_full]
connect_bd_net [get_bd_pins axis_data_fifo_0/s_axis_tready] [get_bd_pins fifo_ready] [get_bd_pins ft_controller_0/fifo_ready]
connect_bd_net -net axis_red_pitaya_adc_0_adc_clk [get_bd_pins aclk] \
  [get_bd_pins floating_point_4/aclk] [get_bd_pins floating_point_3/aclk] [get_bd_pins floating_point_2/aclk] \
  [get_bd_pins floating_point_0/aclk] [get_bd_pins xfft_0/aclk] [get_bd_pins axis_data_fifo_0/s_axis_aclk] \
  [get_bd_pins ft_controller_0/aclk]
connect_bd_net [get_bd_pins floating_point_0/m_axis_result_tdata] [get_bd_pins xfft_0/s_axis_data_tdata]
connect_bd_net [get_bd_pins floating_point_0/m_axis_result_tvalid] [get_bd_pins ft_controller_0/floating_point_valid_in]
connect_bd_net [get_bd_pins ft_controller_0/M_AXIS_OUT_tdata_0] [get_bd_pins floating_point_0/s_axis_a_tdata]
connect_bd_net [get_bd_pins ft_controller_0/M_AXIS_OUT_tlast_0] [get_bd_pins xfft_0/s_axis_data_tlast]
connect_bd_net [get_bd_pins ft_controller_0/M_AXIS_OUT_tvalid_0] [get_bd_pins floating_point_0/s_axis_a_tvalid]
connect_bd_net [get_bd_pins ft_controller_0/S_AXIS_IN_tready_0] [get_bd_pins axis_data_fifo_0/m_axis_tready]
connect_bd_net [get_bd_pins ft_controller_0/adc_or_dac] [get_bd_pins adc_or_dac]
connect_bd_net [get_bd_pins ft_controller_0/debug_fft_out] [get_bd_pins debug_fft_out]
connect_bd_net [get_bd_pins ft_controller_0/debug_fifo_wr_rd] [get_bd_pins debug_fifo_wr_rd]
connect_bd_net [get_bd_pins ft_controller_0/floating_point_valid_out] [get_bd_pins xfft_0/s_axis_data_tvalid]
connect_bd_net [get_bd_pins ft_controller_0/ft_en] [get_bd_pins ft_en]
connect_bd_net [get_bd_pins ft_controller_0/gpio_5] [get_bd_pins gpio_5]
connect_bd_net [get_bd_pins ft_controller_0/sample_frequency] [get_bd_pins sample_frequency]
connect_bd_net -net rst_ps7_0_125M_peripheral_aresetn [get_bd_pins s_axis_aresetn] [get_bd_pins axis_data_fifo_0/s_axis_aresetn]
connect_bd_net [get_bd_pins xfft_0/event_data_in_channel_halt] [get_bd_pins ft_controller_0/event_data_in_channel_halt]
connect_bd_net [get_bd_pins xfft_0/event_data_out_channel_halt] [get_bd_pins ft_controller_0/event_data_out_channel_halt]
connect_bd_net [get_bd_pins xfft_0/event_fft_overflow] [get_bd_pins ft_controller_0/event_fft_overflow]
connect_bd_net [get_bd_pins xfft_0/event_frame_started] [get_bd_pins ft_controller_0/event_frame_started]
connect_bd_net [get_bd_pins xfft_0/event_status_channel_halt] [get_bd_pins ft_controller_0/event_status_channel_halt]
connect_bd_net [get_bd_pins xfft_0/event_tlast_missing] [get_bd_pins ft_controller_0/event_tlast_missing]
connect_bd_net [get_bd_pins xfft_0/event_tlast_unexpected] [get_bd_pins ft_controller_0/event_tlast_unexpected]
connect_bd_net [get_bd_pins xfft_0/s_axis_data_tready] [get_bd_pins ft_controller_0/M_AXIS_OUT_tready_0]

current_bd_instance /WT_level_1
connect_bd_net -net ADC_red_pitaya_M_AXIS_PORT1_tdata [get_bd_pins S_AXIS_IN_tdata] [get_bd_pins adc_sample_2_0/S_AXIS_IN_tdata]
connect_bd_net -net ADC_red_pitaya_M_AXIS_PORT1_tvalid [get_bd_pins S_AXIS_IN_tvalid] [get_bd_pins adc_sample_2_0/S_AXIS_IN_tvalid]
connect_bd_net [get_bd_pins adc_sample_2_0/S_AXIS_OUT_tvalid_0] [get_bd_pins S_AXIS_OUT_tvalid_0]
connect_bd_net [get_bd_pins adc_sample_2_0/S_AXIS_OUT_tdata_0] [get_bd_pins S_AXIS_OUT_tdata_0]
connect_bd_net [get_bd_pins adc_sample_2_0/adc_data_out_high_0] [get_bd_pins c_addsub_1/B]
connect_bd_net [get_bd_pins adc_sample_2_0/adc_data_out_high_1] [get_bd_pins c_addsub_1/A]
connect_bd_net [get_bd_pins adc_sample_2_0/adc_data_out_low_0] [get_bd_pins c_addsub_0/B]
connect_bd_net [get_bd_pins adc_sample_2_0/adc_data_out_low_1] [get_bd_pins c_addsub_0/A]
connect_bd_net [get_bd_pins adc_sample_2_0/adc_data_valid] [get_bd_pins adc_data_valid]
connect_bd_net -net axi_mux_0_S_AXIS_OUT_tdata [get_bd_pins S_AXIS_IN_tdata_dac] [get_bd_pins adc_sample_2_0/S_AXIS_IN_tdata_dac]
connect_bd_net -net axi_mux_0_S_AXIS_OUT_tvalid [get_bd_pins S_AXIS_IN_tvalid_dac] [get_bd_pins adc_sample_2_0/S_AXIS_IN_tvalid_dac]
connect_bd_net -net axis_data_fifo_0_s_axis_tready [get_bd_pins S_AXIS_OUT_tready_0] [get_bd_pins adc_sample_2_0/S_AXIS_OUT_tready_0]
connect_bd_net -net axis_red_pitaya_adc_0_adc_clk [get_bd_pins CLK] \
  [get_bd_pins c_addsub_0/CLK] [get_bd_pins downsample_2_0/clk] [get_bd_pins c_addsub_1/CLK] [get_bd_pins downsample_2_1/clk] \
  [get_bd_pins adc_sample_2_0/clk]
connect_bd_net [get_bd_pins c_addsub_0/S] [get_bd_pins xlslice_0/Din]
connect_bd_net [get_bd_pins c_addsub_1/S] [get_bd_pins xlslice_1/Din]
connect_bd_net -net data_inject_0_data_injection [get_bd_pins data_injection] [get_bd_pins adc_sample_2_0/data_injection]
connect_bd_net -net data_inject_0_data_injection_enable [get_bd_pins data_injection_en] [get_bd_pins adc_sample_2_0/data_injection_en]
connect_bd_net -net debug_mux_0_debug_data_en [get_bd_pins debug_en] [get_bd_pins adc_sample_2_0/debug_en]
connect_bd_net -net debug_mux_0_debug_data_out [get_bd_pins debug_data_injection] [get_bd_pins adc_sample_2_0/debug_data_injection]
connect_bd_net [get_bd_pins downsample_2_0/adc_data_out] [get_bd_pins adc_data_out1]
connect_bd_net [get_bd_pins downsample_2_1/adc_data_out] [get_bd_pins adc_data_out]
connect_bd_net -net ft_controller_0_adc_or_dac [get_bd_pins adc_or_dac] [get_bd_pins adc_sample_2_0/adc_or_dac]
connect_bd_net -net ft_controller_0_ft_en [get_bd_pins ft_en] [get_bd_pins adc_sample_2_0/ft_en]
connect_bd_net -net ft_controller_0_sample_frequency [get_bd_pins freq_div] [get_bd_pins adc_sample_2_0/freq_div]
connect_bd_net [get_bd_pins xlslice_0/Dout] [get_bd_pins downsample_2_0/adc_data_in]
connect_bd_net [get_bd_pins xlslice_1/Dout] [get_bd_pins downsample_2_1/adc_data_in]

current_bd_instance /WT_level_2
connect_bd_net -net adc_sample_2_0_adc_data_valid [get_bd_pins adc_data_in_valid] [get_bd_pins adc_sample_level_2_0/adc_data_in_valid]
connect_bd_net [get_bd_pins adc_sample_level_2_0/adc_data_out_high_0] [get_bd_pins c_addsub_6/B]
connect_bd_net [get_bd_pins adc_sample_level_2_0/adc_data_out_high_1] [get_bd_pins c_addsub_6/A]
connect_bd_net [get_bd_pins adc_sample_level_2_0/adc_data_out_low_0] [get_bd_pins c_addsub_5/B]
connect_bd_net [get_bd_pins adc_sample_level_2_0/adc_data_out_low_1] [get_bd_pins c_addsub_5/A]
connect_bd_net [get_bd_pins adc_sample_level_2_0/adc_data_valid] [get_bd_pins adc_data_valid]
connect_bd_net [get_bd_pins c_addsub_5/S] [get_bd_pins xlslice_2/Din]
connect_bd_net [get_bd_pins c_addsub_6/S] [get_bd_pins xlslice_3/Din]
connect_bd_net -net clk_wiz_0_clk_out2 [get_bd_pins CLK] \
  [get_bd_pins c_addsub_5/CLK] [get_bd_pins downsample_2_2/clk] [get_bd_pins downsample_2_3/clk] \
  [get_bd_pins adc_sample_level_2_0/clk] [get_bd_pins c_addsub_6/CLK]
connect_bd_net -net delay_handler_0_lowpass_lvl_1_to_lvl_2_out [get_bd_pins adc_data_in] [get_bd_pins adc_sample_level_2_0/adc_data_in]
connect_bd_net [get_bd_pins downsample_2_2/adc_data_out] [get_bd_pins adc_data_out]
connect_bd_net [get_bd_pins downsample_2_3/adc_data_out] [get_bd_pins adc_data_out1]
connect_bd_net [get_bd_pins xlslice_2/Dout] [get_bd_pins downsample_2_2/adc_data_in]
connect_bd_net [get_bd_pins xlslice_3/Dout] [get_bd_pins downsample_2_3/adc_data_in]

current_bd_instance /WT_level_1_reconstruction
connect_bd_net -net axis_red_pitaya_adc_0_adc_clk [get_bd_pins CLK] \
  [get_bd_pins c_addsub_3/CLK] [get_bd_pins c_addsub_2/CLK] [get_bd_pins c_addsub_4/CLK] [get_bd_pins upsample_2_0/clk] \
  [get_bd_pins upsample_2_1/clk]
connect_bd_net [get_bd_pins c_addsub_2/S] [get_bd_pins c_addsub_4/A]
connect_bd_net [get_bd_pins c_addsub_3/S] [get_bd_pins c_addsub_4/B]
connect_bd_net [get_bd_pins c_addsub_4/S] [get_bd_pins S]
connect_bd_net -net delay_handler_0_lowpass_lvl_1_to_lvl_final_out [get_bd_pins adc_data_in1] [get_bd_pins upsample_2_0/adc_data_in]
connect_bd_net -net glb_hot_mux_0_out [get_bd_pins adc_data_in] [get_bd_pins upsample_2_1/adc_data_in]
connect_bd_net [get_bd_pins upsample_2_0/adc_data_0_out] [get_bd_pins c_addsub_2/A]
connect_bd_net [get_bd_pins upsample_2_0/adc_data_1_out] [get_bd_pins c_addsub_2/B]
connect_bd_net [get_bd_pins upsample_2_1/adc_data_0_out] [get_bd_pins c_addsub_3/A]
connect_bd_net [get_bd_pins upsample_2_1/adc_data_1_out] [get_bd_pins c_addsub_3/B]

current_bd_instance /ZYNC_and_CFG
connect_bd_intf_net [get_bd_intf_pins DDR] [get_bd_intf_pins processing_system7_0/DDR]
connect_bd_intf_net [get_bd_intf_pins FIXED_IO] [get_bd_intf_pins processing_system7_0/FIXED_IO]
connect_bd_intf_net [get_bd_intf_pins processing_system7_0/M_AXI_GP0] [get_bd_intf_pins ps7_0_axi_periph/S00_AXI]
connect_bd_intf_net [get_bd_intf_pins ps7_0_axi_periph/M00_AXI] [get_bd_intf_pins axi_gpio_0/S_AXI]
connect_bd_intf_net [get_bd_intf_pins ps7_0_axi_periph/M01_AXI] [get_bd_intf_pins axi_gpio_1/S_AXI]
connect_bd_intf_net [get_bd_intf_pins axi_gpio_2/S_AXI] [get_bd_intf_pins ps7_0_axi_periph/M02_AXI]
connect_bd_intf_net [get_bd_intf_pins ps7_0_axi_periph/M03_AXI] [get_bd_intf_pins axi_gpio_3/S_AXI]
connect_bd_net [get_bd_pins axi_gpio_0/gpio2_io_o] [get_bd_pins gpio2_io_o]
connect_bd_net [get_bd_pins axi_gpio_0/gpio_io_o] [get_bd_pins gpio_io_o]
connect_bd_net [get_bd_pins axi_gpio_1/gpio_io_o] [get_bd_pins gpio_io_o1]
connect_bd_net [get_bd_pins axi_gpio_2/gpio_io_o] [get_bd_pins gpio_io_o3]
connect_bd_net [get_bd_pins axi_gpio_3/gpio2_io_o] [get_bd_pins gpio2_io_o1]
connect_bd_net [get_bd_pins axi_gpio_3/gpio_io_o] [get_bd_pins gpio_io_o2]
connect_bd_net -net debug_mux_0_debug_mux_out [get_bd_pins gpio2_io_i] [get_bd_pins axi_gpio_1/gpio2_io_i]
connect_bd_net -net ft_controller_0_gpio_5 [get_bd_pins gpio2_io_i1] [get_bd_pins axi_gpio_2/gpio2_io_i]
connect_bd_net [get_bd_pins processing_system7_0/FCLK_CLK0] \
  [get_bd_pins processing_system7_0/M_AXI_GP0_ACLK] [get_bd_pins processing_system7_0/S_AXI_HP0_ACLK] \
  [get_bd_pins ps7_0_axi_periph/S00_ACLK] [get_bd_pins rst_ps7_0_125M/slowest_sync_clk] [get_bd_pins axi_gpio_0/s_axi_aclk] \
  [get_bd_pins ps7_0_axi_periph/M00_ACLK] [get_bd_pins ps7_0_axi_periph/ACLK] [get_bd_pins axi_gpio_1/s_axi_aclk] \
  [get_bd_pins ps7_0_axi_periph/M01_ACLK] [get_bd_pins ps7_0_axi_periph/M02_ACLK] [get_bd_pins axi_gpio_2/s_axi_aclk] \
  [get_bd_pins ps7_0_axi_periph/M03_ACLK] [get_bd_pins axi_gpio_3/s_axi_aclk]
connect_bd_net [get_bd_pins processing_system7_0/FCLK_RESET0_N] [get_bd_pins rst_ps7_0_125M/ext_reset_in]
connect_bd_net [get_bd_pins rst_ps7_0_125M/peripheral_aresetn] \
  [get_bd_pins peripheral_aresetn] [get_bd_pins ps7_0_axi_periph/S00_ARESETN] [get_bd_pins ps7_0_axi_periph/M00_ARESETN] \
  [get_bd_pins ps7_0_axi_periph/ARESETN] [get_bd_pins axi_gpio_1/s_axi_aresetn] [get_bd_pins ps7_0_axi_periph/M01_ARESETN] \
  [get_bd_pins ps7_0_axi_periph/M02_ARESETN] [get_bd_pins axi_gpio_2/s_axi_aresetn] \
  [get_bd_pins ps7_0_axi_periph/M03_ARESETN] [get_bd_pins axi_gpio_3/s_axi_aresetn] [get_bd_pins axi_gpio_0/s_axi_aresetn]
